# EAGLE board ESP32 Display-1.28-V1.0 (EAGLE 9.6.2)
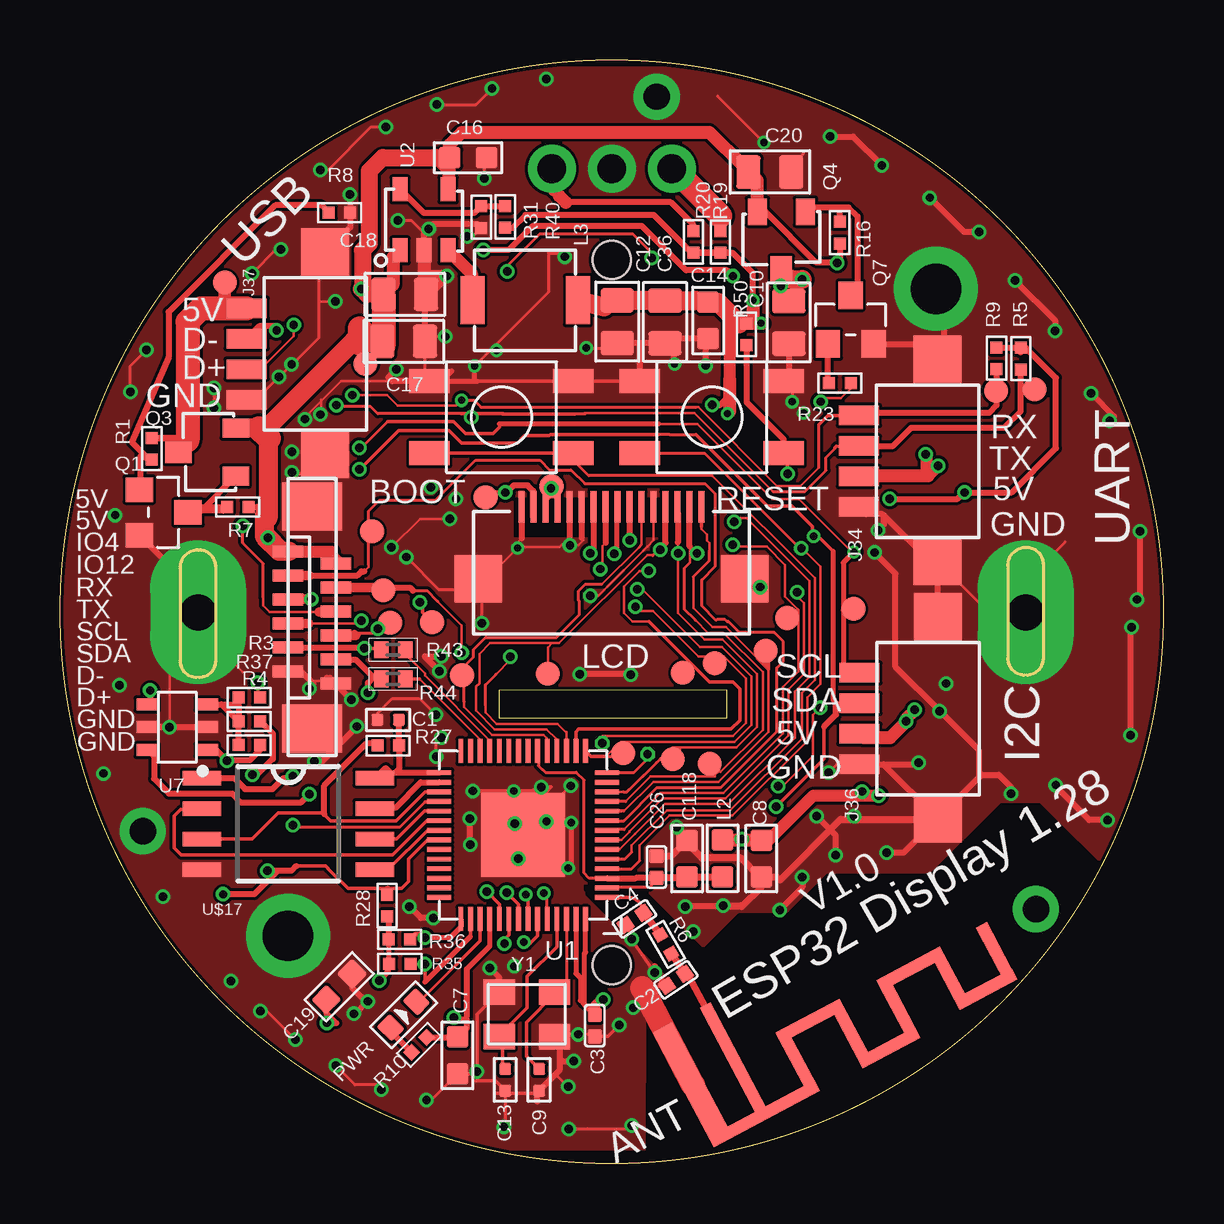
[diagram p6: board, top side]
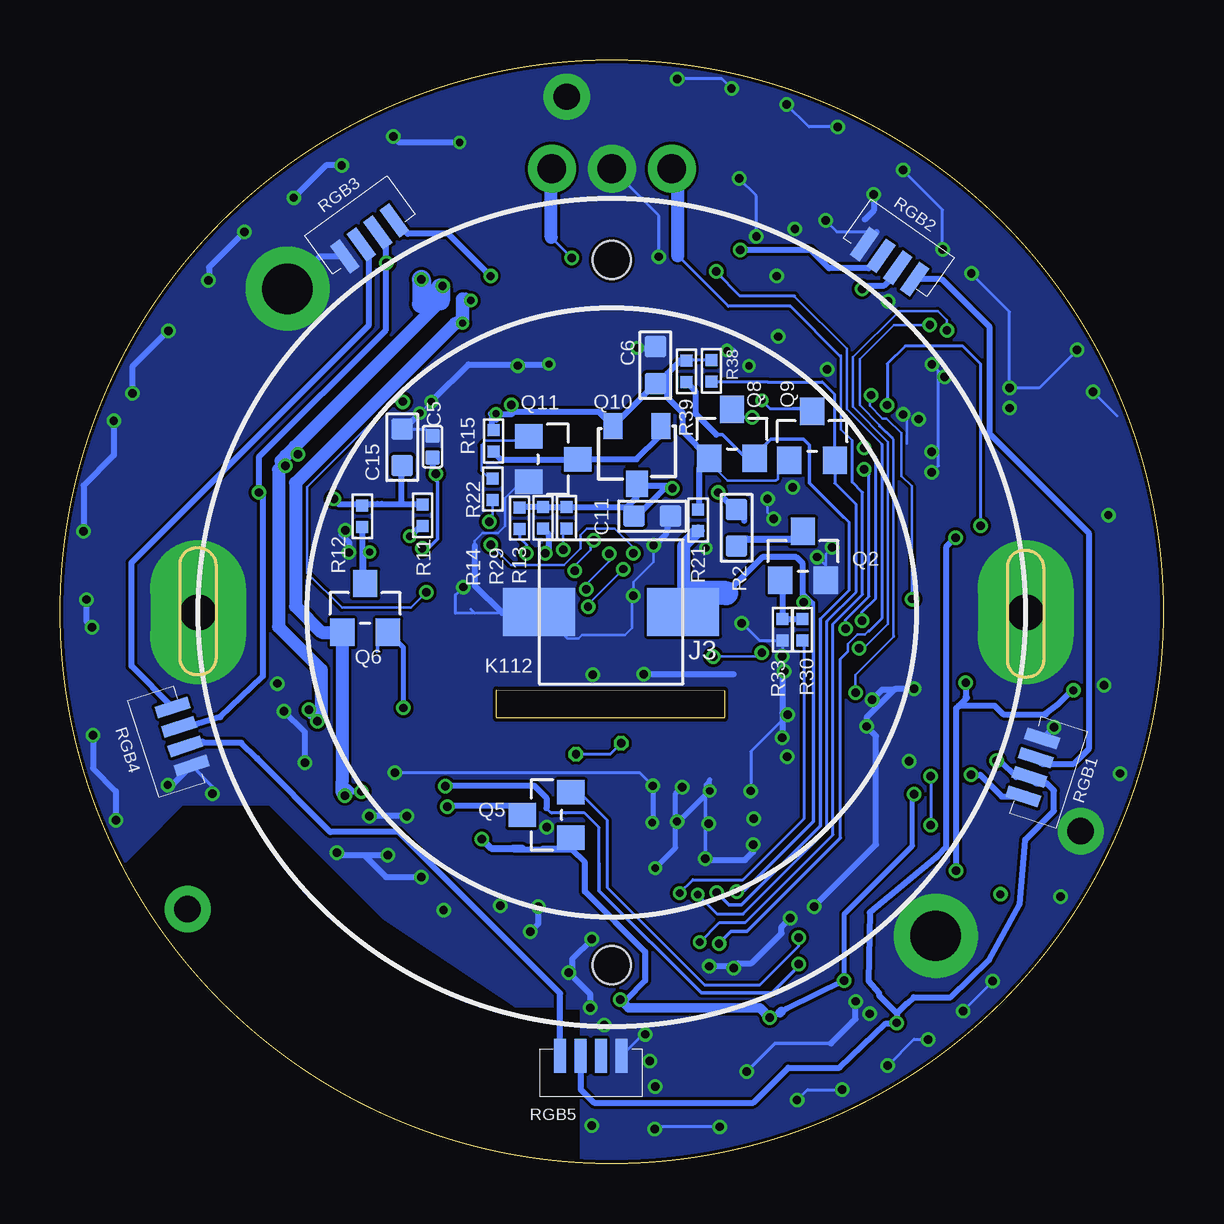
[diagram p7: board, bottom side, seen from below]

Size 46 x 46 mm. Coordinates in mm from the lower left corner, seen from the top.
Outline: 18.3,19.72 18.3,18.57 27.8,18.58 27.8,19.73 18.3,19.72
Outline: circle at 23,23 radius 23
Copper layers (1*16): Top 0.035mm / dielectric 1.5mm / Bottom 0.035mm
Design rules "default *": minimum track width 3mil, minimum drill 0.3mm, track to track 4mil, track to pad 4mil, pad to pad 4mil, via to via 4mil, smd to smd 5mil, copper to edge 6mil, drill to drill 6mil, minimum pad ring 5mil, minimum via ring 5mil, stop-mask expansion 4mil, vias tented up to drill 30mil, thermal gap 5mil
Net classes: 0 default: clearance 0.12 mm; 1 PWR: width 0.254 mm, clearance 0.12 mm to class 0, clearance 0.12 mm

## Footprints (pad centres in the part's own frame; a part is rotated, then mirrored left to right if it is on the bottom)
BT_ANT = smd 0.9 x 5.4: P$1 0,0 | smd 0.5 x 5.4: P$2 -2,0 | smd 5 x 0.5: P$3 -2.053,2.455 | smd 0.5 x 3: P$4 -4.305,1.198; P$6 -6.82,1.195 | smd 3 x 0.5: P$5 -5.57,-0.06; P$9 -10.285,-0.01 | smd 2.7 x 0.5: P$7 -7.93,2.465; P$11 -12.65,2.21 | smd 0.5 x 2.7: P$8 -9.045,1.37; P$10 -11.53,1.095; P$12 -13.74,1.105
SW-4.5*4.5 = smd 1.676 x 1: P$1 -3,1.5; P$2 -3,-1.5; P$3 3,-1.5; P$4 3,1.5
0402 = smd 0.5 x 0.5: 1 -0.45,0; 2 0.45,0
C0402 = smd 0.6 x 0.6: 1 -0.45,0; 2 0.45,0
0603 = smd 0.889 x 0.889: 1 -0.762,0; 2 0.762,0
C0603 = smd 0.889 x 0.889: 1 -0.762,0; 2 0.762,0
0805 = smd 1.016 x 1.397: 1 -0.889,0; 2 0.889,0
EC3501-C15H30P3 = drill 1.2 pad 2: 1 -2.5,-18.5; 2 0,-18.5; 3 2.5,-18.5 | drill 1.5 pad 4 long: 4 -17.25,0; 5 17.25,0 | hole 1.6: 0,14.7; 0,-14.7
1.25-4P立贴 = smd 0.813 x 1.676: 1 1.27,2; 2 0,2; 3 -1.27,2; 4 -2.54,2 | smd 2 x 2: 5 -4.8,-1.27; 6 3.6,-1.27
BUTTON_2P = smd 3 x 2: P$1 0,0; P$2 6,0
L0603 = smd 0.889 x 0.889: 1 -0.762,0; 2 0.762,0
L0420 = smd 2 x 1: 1 0,2.2; 2 0,-2.2
0.5MM-16P = smd 0.27 x 1.27: 1 -5.08,2.54; 2 -4.58,2.54; 3 -4.08,2.54; 4 -3.58,2.54; 5 -3.08,2.54; 6 -2.58,2.54; 7 -2.08,2.54; 8 -1.58,2.54; 9 -1.08,2.54; 10 -0.58,2.54; 11 -0.08,2.54; 12 0.42,2.54; 13 0.92,2.54; 14 1.42,2.54; 15 1.92,2.54; 16 2.42,2.54 | smd 2 x 2: 17 -6.88,-0.46; 18 4.22,-0.46
PAD-1.0MM = smd 1 x 1: P$1 0,0
LED-0603 = smd 0.762 x 0.889: + -0.762,0; - 0.762,0
SOT23@1 = smd 1.016 x 1.143: 1 -0.95,-1.016; 2 0.95,-1.016; 3 0,1.016
SOT23 = smd 1.016 x 1.143: 1 -0.95,-1.016; 2 0.95,-1.016; 3 0,1.016
SOT-23 = smd 1.1 x 0.8: 1 1.2,-1; 2 1.2,1 | smd 1.1 x 0.9: 3 -1.2,0
0402' = smd 0.5 x 0.5: P$1 -0.45,0; P$2 0.45,0
R0603 = smd 0.889 x 0.889: 1 -0.762,0; 2 0.762,0
R0402 = smd 0.6 x 0.7: 1 -0.5,0; 2 0.5,0
RGB4020 = smd 0.5 x 1.422: 1 0,0; 2 -0.85,0; 3 -1.7,0; 4 -2.55,0
T-2.5 = drill 2.1 pad 3.5: 1 0,0
ESP-S3-QFN56(7×7MM) = smd 1 x 0.2: 1 -3.5,2.6; 2 -3.5,2.2; 3 -3.5,1.8; 4 -3.5,1.4; 5 -3.5,1; 6 -3.5,0.6; 7 -3.5,0.2; 8 -3.5,-0.2; 9 -3.5,-0.6; 10 -3.5,-1; 11 -3.5,-1.4; 12 -3.5,-1.8; 13 -3.5,-2.2; 14 -3.5,-2.6; 29 3.5,-2.6; 30 3.5,-2.2; 31 3.5,-1.8; 32 3.5,-1.4; 33 3.5,-1; 34 3.5,-0.6; 35 3.5,-0.2; 36 3.5,0.2; 37 3.5,0.6; 38 3.5,1; 39 3.5,1.4; 40 3.5,1.8; 41 3.5,2.2; 42 3.5,2.6 | smd 0.2 x 1: 15 -2.6,-3.5; 16 -2.2,-3.5; 17 -1.8,-3.5; 18 -1.4,-3.5; 19 -1,-3.5; 20 -0.6,-3.5; 21 -0.2,-3.5; 22 0.2,-3.5; 23 0.6,-3.5; 24 1,-3.5; 25 1.4,-3.5; 26 1.8,-3.5; 27 2.2,-3.5; 28 2.6,-3.5; 43 2.6,3.5; 44 2.2,3.5; 45 1.8,3.5; 46 1.4,3.5; 47 1,3.5; 48 0.6,3.5; 49 0.2,3.5; 50 -0.2,3.5; 51 -0.6,3.5; 52 -1,3.5; 53 -1.4,3.5; 54 -1.8,3.5; 55 -2.2,3.5; 56 -2.6,3.5 | smd 3.5 x 3.5: 57 0,0
SOT23-5 = smd 1 x 0.635: 1 -1.27,1; 2 -1.27,0; 3 -1.27,-1; 4 1.27,-1; 5 1.27,1
SOT23-6L = smd 0.5 x 0.9: 1 -0.961,-1.212; 2 -0.011,-1.212; 3 0.94,-1.212; 4 0.94,1.288; 5 -0.011,1.288; 6 -0.961,1.288
FLASHSOP8_SOP8 = smd 0.6 x 1.6: 1 -1.905,-3.6; 2 -0.635,-3.6; 3 0.635,-3.6; 4 1.905,-3.6; 5 1.905,3.6; 6 0.635,3.6; 7 -0.635,3.6; 8 -1.905,3.6
CON-0.5-12P-U = smd 0.5 x 1.27: P$1 0,-2; P$2 0.5,0; P$3 1,-2; P$4 1.5,0; P$5 2,-2; P$6 2.5,0; P$7 3,-2; P$8 3.5,0; P$9 4,-2; P$10 4.5,0; P$11 5,-2; P$12 5.5,0 | smd 2 x 2.5: P$13 -1.88,-1; P$14 7.38,-1
T-2-1.1 = drill 1.1 pad 1.93: P$1 0,0
CRYSTAL-3.2-2.5 = smd 1.3 x 1.05: 1 -1.15,-0.925; 2 1.15,-0.925; 3 1.15,0.925; 4 -1.15,0.925

## Placement (x,y rotation side)
ANT  BT_ANT  [BT_ANT]  26.39,3.28 208 top
BOOT  BOOT  [SW-4.5*4.5]  18.4,31.11 0 top
C1  1UF  [0402]  13.68,18.49 180 top
C2  NC  [C0402]  25.67,7.66 34 top
C3  1uF  [C0402]  22.29,5.75 90 top
C4  NC  [C0402]  23.94,10.2 34 top
C5  1uF  [C0402]  30.47,29.88 270 bottom
C6  100NF  [0603]  21.18,33.28 90 bottom
C7  1uF  [C0603]  16.57,4.51 270 top
C8  10NF  [C0603]  29.23,12.71 270 top
C9  12pF  [0402]  19.97,3.49 270 top
C10  22uF  [0805]  30.38,35.06 90 top
C11  100NF  [0603]  21.31,26.98 0 bottom
C12  22uF  [0805]  23.23,35.09 90 top
C13  12pF  [0402]  18.56,3.49 270 top
C14  100NF  [C0603]  27.02,35.14 270 top
C15  100NF  [0603]  31.73,29.86 90 bottom
C16  100NF  [0603]  17.01,41.92 0 top
C17  22uF  [0805]  14.33,34.27 180 top
C18  22uF  [0805]  14.37,36.23 180 top
C19  100NF  [0603]  11.64,7.37 45 top
C20  22uF  [0805]  29.59,41.33 180 top
C26  1uF  [C0402]  24.86,12.36 90 top
C36  22uF  [0805]  25.22,35.08 90 top
C118  NC/3PF  [0603]  26.14,12.71 270 top
J3  EC3501-C15H30P3  [EC3501-C15H30P3]  23,22.97 180 bottom
J34  1.25-4P-SMT-A  [1.25-4P立贴]  35.3,29.91 90 top
J36  1.25-4P-SMT-A  [1.25-4P立贴]  35.32,19.18 90 top
J37  1.25-4P-SMT-A  [1.25-4P立贴]  9.78,34.38 90 top
K112  BUTTON_2P  [BUTTON_2P]  26.03,22.99 0 bottom
L2  100M-600R  [L0603]  27.62,12.72 270 top
L3  2.2UH  [L0420]  19.39,35.98 90 top
LCD  LCD-1.28-16P-1.28  [0.5MM-16P]  24.32,24.83 0 top
P1  [PAD-1.0MM]  17.74,27.78 0 top
P2  [PAD-1.0MM]  20.49,28.23 0 top
P3  [PAD-1.0MM]  30.32,22.74 0 top
P4  [PAD-1.0MM]  27.29,20.85 0 top
P5  [PAD-1.0MM]  23.47,17.11 0 top
P6  [PAD-1.0MM]  25.96,20.45 0 top
P7  [PAD-1.0MM]  16.76,20.35 0 top
P8  [PAD-1.0MM]  20.34,20.41 0 top
P9  [PAD-1.0MM]  25.55,16.85 0 top
P10  [PAD-1.0MM]  27.08,16.66 0 top
P11  [PAD-1.0MM]  29.41,21.38 0 top
P12  [PAD-1.0MM]  13.01,26.35 0 top
P13  [PAD-1.0MM]  13.47,23.9 0 top
P14  [PAD-1.0MM]  39.02,32.21 0 top
P15  [PAD-1.0MM]  40.63,32.27 0 top
P16  [PAD-1.0MM]  33.08,23.12 0 top
P17  [PAD-1.0MM]  13.76,22.55 0 top
P18  [PAD-1.0MM]  15.51,22.57 0 top
P19  [PAD-1.0MM]  6.87,36.72 0 top
P20  [PAD-1.0MM]  12.73,33.34 0 top
PWR  Green  [LED-0603]  14.32,6.2 45 top
Q1  S9013  [SOT23@1]  4.32,27.14 270 top
Q2  BSN20  [SOT23]  15.03,25.33 0 bottom
Q3  PMOS-3401-4A  [SOT-23]  6.13,29.65 0 top
Q4  PMOS-3401-4A  [SOT-23]  30.07,38.47 90 top
Q5  BSN20  [SOT23]  25.72,14.53 90 bottom
Q6  BSN20  [SOT23]  33.28,23.16 0 bottom
Q7  S9013  [SOT23@1]  32.96,35.18 0 top
Q8  BSN20  [SOT23]  17.99,30.42 0 bottom
Q9  BSN20  [SOT23]  14.65,30.33 0 bottom
Q10  PMOS-3401-4A  [SOT-23]  21.95,29.54 90 bottom
Q11  S9013  [SOT23@1]  25.44,29.36 270 bottom
R1  10K  [0402']  3.83,29.8 90 top
R2  10R  [R0603]  17.8,26.5 90 bottom
R3  NC  [0402']  7.89,19.42 0 top
R4  10K  [0402']  7.89,17.44 0 top
R5  10k  [0402']  40.05,33.55 90 top
R6  0R  [0402']  25.25,9.14 120 top
R7  10K  [0402']  7.41,27.37 0 top
R8  10K  [0402']  11.65,39.64 180 top
R9  10k  [0402']  39.04,33.57 90 top
R10  1K  [0402']  14.97,4.95 45 top
R11  10k  [0402']  30.89,27.02 90 bottom
R12  10k  [0402']  33.4,26.98 90 bottom
R13  10K  [0402']  24.89,26.92 270 bottom
R14  10K  [0402']  26.84,26.9 270 bottom
R15  10K  [0402']  27.93,30.12 90 bottom
R16  10K  [0402']  32.5,38.8 270 top
R19  10K  [0402']  27.53,38.41 270 top
R20  10K  [0402']  26.4,38.42 270 top
R21  10K  [0402']  19.4,26.82 90 bottom
R22  10K  [0402']  27.96,28.11 270 bottom
R23  10K  [0402']  32.51,32.53 0 top
R27  10K  [0402']  13.68,17.42 180 top
R28  4.7K  [0402']  13.64,10.75 270 top
R29  10K  [0402']  25.87,26.92 270 bottom
R30  10K  [0402']  15.05,22.25 90 bottom
R31  24K  [0402']  17.56,39.45 90 top
R33  100K  [0402']  15.89,22.25 90 bottom
R35  10k  [0402']  14.17,8.33 180 top
R36  10k  [0402']  14.15,9.35 0 top
R37  100R  [0402']  7.89,18.43 180 top
R38  10k  [0402']  18.84,33.04 90 bottom
R39  10k  [0402']  19.89,33.02 270 bottom
R40  110K  [0402']  18.56,39.46 270 top
R43  10R  [R0402]  13.89,21.42 0 top
R44  10R  [R0402]  13.89,20.2 0 top
R50  10K  [0402']  28.62,34.56 270 top
RESET  RESET  [SW-4.5*4.5]  27.17,31.11 180 top
RGB1  RGB4020_E  [RGB4020]  5.85,15.3 252 bottom
RGB2  RGB4020_E  [RGB4020]  10.38,36.86 325 bottom
RGB3  RGB4020_E  [RGB4020]  32.06,39.31 36 bottom
RGB4  RGB4020_E  [RGB4020]  41.3,19.01 108 bottom
RGB5  RGB4020_E  [RGB4020]  25.15,4.49 180 bottom
T1  T2.5-A  [T-2.5]  9.5,9.49 0 bottom
T2  T2.5-A  [T-2.5]  36.52,36.46 0 top
U1  ESP-S3-QFN56(7×7MM)  [ESP-S3-QFN56(7×7MM)]  19.31,13.69 180 top
U2  RY3420  [SOT23-5]  15.18,39.34 90 top
U7  AIP74LVC1T45GB236  [SOT23-6L]  4.93,18.2 90 top
U$17  FLASHSOP8_W25X20CL  [FLASHSOP8_SOP8]  9.52,14.16 270 top
U$27  CON-12P-0.5-U  [CON-0.5-12P-U]  11.5,25.51 270 top
U$28  T-2-1.1  [T-2-1.1]  3.45,13.85 0 top
U$30  T-2-1.1  [T-2-1.1]  40.68,10.6 0 bottom
U$31  T-2-1.1  [T-2-1.1]  24.88,44.47 0 top
Y1  3225_40M  [CRYSTAL-3.2-2.5]  19.46,6.22 180 top

## Tracks (layer width: path | path; a pad name or v marks a point on that pad's centre or on a via)
3.3V
  Top 0.127: U1.20 19.94,17.16 19.94,16.58 20.1,16.42 20.12,16.42 20.23,16.31 21.52,16.31 21.85,15.99 21.85,12.11 22.06,11.89 U1.3 | U1.2 22.84,11.52 24.58,11.52 24.96,11.9
  Top 0.254: C26.1 24.96,11.9 24,11.9 23.99,11.89 U1.3
  Top 0.3: 24.96,11.9 26.09,11.9 C118.2 27.61,11.95 L2.2
22
  cutout Top: 24.11,11.64 27.58,8.17 25.98,7.13 21.92,11.19 21.92,11.33 21.86,11.39 21.86,11.62
33
  cutout Top: 18.93,27.72 18.93,26.14 26.96,26.14 27.05,26.05 27.05,27.43 27.35,27.73 18.94,27.73
ESP_RXD  (via drill 0.3)
  Top 0.152: v19.42,11.21 19.51,11.12 U1.50
  Bottom 0.12: 13.4,29.61 13.68,29.33 Q9.2
  Bottom 0.125: v19.42,11.21 18.61,10.4 17.53,10.4 14.03,13.9 14.03,22.61 12.81,23.83 12.81,27.47 13.7,28.36 Q9.2 | 13.72,32.08 13.72,29.37 13.68,29.33
  Bottom 0.127: R38.P$1 16.5,32.59 16.51,32.58 14.22,32.58 13.72,32.08 | 13.27,29.75 13.4,29.61
ESP_TXD  (via drill 0.35)
  Top 0.152: v18.62,11.29 19.11,10.8 U1.49
  Bottom 0.125: 14.3,22.7 13.1,23.9 13.1,26.72 13.32,26.94 13.34,26.94
  Bottom 0.152: 18.64,30.38 18.39,30.38 17.41,29.4 Q8.2 17.04,29.52 16.37,30.19 15.02,30.19 14.77,29.94 14.77,28.37 13.34,26.94 | v18.62,11.29 18.12,10.79 17.59,10.79 14.3,14.08 14.3,22.7
  Bottom 0.254: 18.64,30.38 19.52,31.26 19.52,32.2 R39.P$2
GND  (via drill 0.3, 0.35)
  Top 0.1: 19.24,26.06 18.88,25.7 19.11,25.7 | 19.11,25.7 v19.07,25.66 17.44,24.03 | 17.44,24.03 17.44,23.93 | 17.44,24.03 LCD.17 | 19.11,25.7 20.82,25.7 20.9,25.78 | 21.25,26.12 20.9,25.78 | 21.74,26.09 21.83,26 21.61,25.78 v21.26,25.78 20.9,25.78 | 24.75,26.9 24.75,25.98 24.49,25.71 22.44,23.67 v22.1,23.67 | 11.13,20.24 11.01,20.12 10.57,20.12 10.57,20 | v10.39,19.8 10.39,20.18 | 7.61,20.49 5.98,22.12 | 5.98,22.12 5.75,22.35 J3.4 | v4.57,18.18 4.57,20.71 5.98,22.12 | 13.86,32.61 11.72,32.61 10.18,31.07 v10.21,31.03 | 10.88,31.85 10.88,31.26 v10.85,31.22 | v13.82,25.69 15,26.87 v16.25,26.87 | C17.1 15.42,34.47 v16.07,34.47 | 10.8,35.96 10.83,35.93 v11.48,35.93
  Top 0.12: 25.49,7.41 C2.1
  Top 0.125: v29.19,24.03 28.66,24.03 LCD.18 | C1.2 13.23,18.76 13.85,19.38 14.99,19.38 v15.66,18.71 | v32.04,16.3 32.38,16.64 J36.4 | 36.53,14.44 36.44,14.35 35.24,14.35 | 11.04,29.5 J37.5 11.05,28.74 9.73,28.74 v9.66,28.81 | 15.18,38.78 14.65,39.31 v14.09,39.31 | 17.14,39.16 17.02,39.16 | R31.P$1 17.21,38.65 v16.97,38.65 | v17.69,41.06 17.69,41.84 C16.2 | v29.34,42.56 27.41,44.49 | 36.86,33.8 36.71,33.65 J34.6 37.31,32.77 | RESET.P$2 30.23,32.55 30.52,32.26 v30.52,31.76 | 31,42.14 C20.1 | J34.5 38.7,22.98 40.26,22.98 | J3.5 40.25,24.26 41.9,25.91 | v14.44,25.28 15.79,23.93 17.44,23.93 | J37.4 8.11,32.17 8.52,32.17 v9.65,33.3 9.69,33.3 10.8,34.42 10.8,35.96 10.8,37.73 J37.6 | BOOT.P$1 15.22,32.79 C17.1 | v21.04,37.8 21.04,37.95 20.36,37.95 20.36,36.33 v17.28,33.25 17.92,33.89 v18.2,33.89 | 17.38,3.47 17.38,3.75 | Y1.4 20.7,5.39 v21.61,5.39 22.21,5.39 C3.1 | LCD.17 17.57,23.78 v17.57,22.53 v17.58,22.52 | 23.1,5.56 v23.32,5.78 | 20.62,3.69 20.7,3.69 v21.18,3.2 | C13.2 18.56,1.61 18.5,1.55 v18.5,1.53 | v21.21,1.44 21.96,1.44 21.97,1.45 23.68,1.45 v23.82,1.59 v23.83,1.59 | C7.2 15.46,2.64 v15.28,2.64 | v13.4,3.08 13.2,3.28 12.3,3.28 v11.5,4.08 | v9.81,5.17 8.62,6.36 v8.35,6.36 | v2.48,19.93 2.37,20.04 | v2.93,32.16 2.93,33.24 v3.6,33.91 | v6.42,32.33 v6.42,31.49 | v9.21,38.11 9.02,38.11 v8.01,37.1 | v10.86,41.41 11.17,41.41 12.97,43.21 v13.58,43.21 | v15.71,44.14 17.34,44.14 v18.01,44.81 | 36.96,19.98 v36.93,20.01 | v15.68,16.96 15.68,17.67 15.76,17.75 v15.89,17.75 | 24.28,7.32 C2.1
  Top 0.127: v21.94,34 23.03,34 C12.1 | U1.57 19.31,13.76 v21.29,15.74
  Top 0.152: BOOT.P$1 15.91,32.61 17.23,32.61 | 17.4,32.61 BOOT.P$4 RESET.P$3 | C9.2 19.89,2.97 19.86,2.93 18.67,2.93 | 18.67,2.93 C13.2 18.16,3.44 17.35,3.44 17.38,3.47 | C7.2 17.38,3.75 v17.38,3.82 | Y1.2 17.39,6.23 17.39,5.95 17.38,5.94 v17.38,3.82 | 18.12,2.93 18.67,2.93 | v17.38,3.82 v17.38,3.83 | 19.76,15.53 v18.92,15.53 v17.2,15.53 | v20.07,15.7 20.48,15.7 20.28,15.5 v20.28,14.26 19.04,14.26 v18.95,14.17 | 39.65,15.68 v39.65,15.41 | v23.83,9.35 24.76,7.99 v24.78,7.95 24.85,7.86 C2.1
  Top 0.154: C3.1 22.84,5.3 23.1,5.56
  Top 0.2: 16.34,33.04 15.91,32.61 | 20.86,5.3 20.79,5.23 20.73,5.18 | v21.31,14.21 21.31,12.43 v21.19,12.31 | BOOT.P$1 17.23,32.61 | 17.23,32.61 17.4,32.61 | 17.23,32.61 17.28,32.66 v17.28,33.25
  Top 0.25: LCD.1 19.24,26.06 | LCD.5 21.25,26.91 21.25,26.12 | LCD.6 21.74,26.09
  Top 0.254: 25.27,34.24 25.41,34.38 C14.2 26.91,34.27 v26.91,33.26 | 25.27,34.24 C36.1 24.3,34.2 | 24.3,34.2 C12.1 | 40.26,22.98 J3.5 | C2.1 24.82,7.89 24.82,8.21 24.79,8.24 | 20.73,5.18 Y1.4 | 19.89,2.59 19.89,2.97 | 23,41.42 J3.2 | 40.82,22.43 40.26,22.98 | 40.52,23.24 40.26,22.98 | RESET.P$3 24.17,34.07 24.3,34.2 | v25.62,33.32 25.58,33.36 25.58,33.93 25.27,34.24 | U1.57 19.31,15.08 19.76,15.53 | LCD.12 24.75,26.9 | C17.1 15.22,36.19 C18.1 | U2.2 15.18,38.78 v15.37,38.97 15.56,39.16 17.02,39.16 | 17.14,39.16 17.4,39.16 R31.P$1 | J34.4 33.6,27.07 34.29,27.07 | Q1.2 5.7,23.79 5.7,23.02 J3.4 | J36.6 36.59,25.09 J34.5 36.26,25.11 34.35,27.02 34.35,26.65 v34.1,26.4 | J37.6 12.1,39.03 R8.P$1 12.1,40.37 v12.08,40.39 | C9.2 20.62,3.69 20.84,3.91 20.84,4.37 | 20.79,5.23 20.84,5.18 20.84,4.37 | v4.57,18.18 v4.56,18.19 U7.5 U7.2 | J36.5 38.3,16.09 | 38.3,16.09 38.41,16.2 39.13,16.2 39.65,15.68 | J36.5 36.53,14.44 34.33,16.64 J36.4 35.73,16.64 v35.79,16.7 | 11.13,20.24 11.24,20.24 v12.14,19.34 | v12.38,18.22 10.91,16.75 10.61,16.75 v10.61,16.77 | v15.82,20.52 15.2,21.14 v15.89,21.14 | Y1.2 18.31,7.76 v17.92,8.15 | v15.56,10.23 15.05,10.23 v14.57,10.71 | v17.11,13.3 17.09,13.32 v17.09,14.37 | v21.67,20.39 21.7,20.42 23.75,20.42 v23.79,20.38 | v33.95,25.47 34.83,24.59 34.83,20.7 v36.67,18.86 38.3,17.23 38.3,16.09 | J36.5 35.16,12.95 v34.46,12.95 | v32.34,12.86 32.34,13.68 v31.54,14.48 v31.55,14.49 | 36.86,33.8 36.86,36.12 T2.1 | BOOT.P$1 13.86,32.61 13.7,32.77 v14.02,33.1 | v32.1,42.81 33.06,42.81 v34.26,41.61 | v36.26,40.26 37.68,38.84 v38.31,38.84 | v39.81,36.81 41.48,35.14 v41.48,34.71 | v42.98,32.11 43.95,31.14 v43.76,30.96
  Top 0.254: v45.02,26.35 45.02,23.63 v44.9,23.51 | v44.66,22.36 44.62,22.32 v44.62,17.85 | v43.67,14.32 42.9,14.32 41.51,15.71 v41.51,15.78 | v30.94,11.94 30.94,11.52 v30,10.58 v30.01,10.57 | v12.84,6.76 12.79,6.71 | 12.79,6.71 12.32,6.24 v12.25,6.24 | 20.84,4.37 20.94,4.27 v21.41,4.27 | C4.1 23.83,9.69 v23.83,9.35 | v27.64,10.75 27.6,10.71 v26.07,10.71 | C118.1 25.76,13.85 25.76,13.97 v25.71,14.02 | C10.1 30.38,32.71 30.23,32.55 | Q7.2 36.19,34.16 36.71,33.65 | C19.2 12.18,7.32 12.79,6.71 | U$27.P$11 10.06,20.51 10.39,20.18 10.57,20
  Top 0.3: C118.1 26.08,13.41 | 26.08,13.41 25.48,12.81 C26.2 | C8.2 29.16,11.95 28.38,12.73 26.76,12.73 26.08,13.41 | C8.2 29.86,11.95 30,11.81 32.54,14.35 36.44,14.35 | v27.64,10.75 28.38,10.75 28.42,10.71 29.23,11.52 C8.2
  Top 0.54: U2.2 15.18,37.03 15.22,36.99 v16.13,36.99 16.02,36.99 15.22,36.19
  Top 1: ANT.P$1 24.28,7.32
  Bottom 0.1: v31,31.28 v30.52,31.76 30.44,31.84 | v21.26,25.78 21.26,25.69 21.26,25.07 22.1,24.23 v22.1,23.67 22.16,23.61 22.16,22.33 22.45,22.04 24.24,22.04 24.39,21.89 24.85,21.89 24.86,21.91 25.28,22.32 | K112.P$1 26.08,22.94 26.65,22.94 28.71,22.94 29.52,22.94 | 28.71,25.76 28.71,25.94 28.38,26.27 27.75,26.27 27.45,26.57 27.45,27.74 26.78,28.41 Q11.2 | v10.85,31.22 10.7,31.07 10.7,30.01 | Q2.2 14.08,25.41 13.82,25.67 v13.82,25.69 | v16.25,26.87 16.51,27.13 v16.51,27.71
  Bottom 0.125: v29.19,24.03 29.52,23.7 29.52,22.94 | v17.2,15.53 17.2,17.17 v15.66,18.71 15.75,18.8 15.89,18.8 | v21.29,15.74 21.85,16.3 v32.04,16.3 | R33.P$1 v15.89,21.14 | v14.09,39.31 13.62,38.84 11.96,38.84 | v16.97,38.65 16.97,40.34 v17.69,41.06 | C15.2 30.76,30.62 C5.1 | 14.08,24.92 v14.44,25.28 | v21.04,37.8 21.04,39.51 J3.2 | 28.88,23.11 28.71,22.94 | RGB5.4 21.71,5.39 v21.61,5.39 | v9.66,28.81 9.38,29.09 9.38,33.03 v9.65,33.3 | 24.86,21.91 25.76,22.8 25.85,22.8 | v18.5,1.53 21.12,1.53 v21.21,1.44 | v15.28,2.64 14.84,3.08 v13.4,3.08 | v11.5,4.08 10.4,5.18 v9.81,5.18 v9.81,5.17 | v8.35,6.36 7.12,7.59 v7.12,7.61 | 2.19,26.92 v2.3,27.03 | 1.94,31.17 v2.93,32.16 | v3.6,33.91 5.18,32.33 v6.42,32.33 6.42,35.51 v8.01,37.1 | v9.21,38.11 9.21,39.76 v10.86,41.41 | v13.58,43.21 14.78,43.21 v15.71,44.14 | v18.01,44.81 18.41,45.21 v20.27,45.21
  Bottom 0.127: v17.58,22.52 17.56,22.52 16.84,21.8 R33.P$1
  Bottom 0.152: v17.38,3.83 16.2,5.01 13.86,5.01 | 27.75,10.59 v27.64,10.75 | 17.11,15.52 v17.19,15.52 v17.2,15.53 | 18.92,15.99 19.1,15.81 v19.1,12.7 | RGB4.4 39.65,15.72 v39.65,15.41
  Bottom 0.2: v21.29,15.74 21.29,14.21 v21.3,14.2 v21.31,14.21 | v21.19,12.31 20.34,13.16 20.34,15.42 v20.07,15.7 | 18.92,15.99 v18.92,15.53 20.19,14.26 v20.28,14.26 | 17.92,33.89 v18.2,33.89
  Bottom 0.254: C15.2 31.66,30.62 v31,31.28 | 30.44,31.84 28.97,33.31 25.72,33.31 25.68,33.27 v25.62,33.32 | 40.45,16.52 RGB4.4 41.32,15.78 v41.51,15.78 | RGB2.4 11.96,38.84 | v12.08,40.39 12.08,39.72 12.46,39.35 | RGB1.4 5.02,17.73 v4.57,18.18 | K112.P$1 25.85,22.8 25.36,22.32 | v12.14,19.34 11.72,19.76 11.21,19.76 | 10.3,19.8 v10.39,19.8 11.17,19.8 11.21,19.76 | 11.21,19.76 12.38,18.59 v12.38,18.22 11.98,17.82 11.98,13.3 v14.57,10.71 | v15.89,17.75 15.89,18.8 15.89,20.45 v15.82,20.52 | 15.51,10.23 v15.56,10.23 15.92,9.87 15.92,9.6 17.17,8.35 17.72,8.35 v17.92,8.15 17.99,8.22 v18.93,8.22 | v19.1,12.7 19.05,12.65 17.44,12.65 17.11,12.98 v17.11,13.3 | 17.92,20.39 v21.67,20.39 | v35.79,16.7 35.79,17.98 v36.67,18.86 | v34.1,26.4 34.27,26.23 33.95,25.91 v33.95,25.47 | v34.46,12.95 34.37,12.86 33.33,12.86 | 33.33,12.86 v32.34,12.86 | v31.55,14.49 v33.11,14.49 v33.11,14.48 | RGB3.4 35.17,37.81 T2.1 | v29.34,42.56 31.85,42.56 v32.1,42.81 | v34.26,41.61 34.91,41.61 v36.26,40.26 | v38.31,38.84 39.79,37.36 39.79,36.83 v39.81,36.81 | v41.48,34.71 42.98,33.21 v42.98,32.11 | v43.76,30.96 43.76,29.53 45.02,28.27 v45.02,26.35 | v44.9,23.51 44.9,22.6 v44.66,22.36 | v44.62,17.85 44.62,16.47 43.67,15.52 v43.67,14.32 | 33.33,12.86 32.41,11.94 v30.94,11.94 | 13.86,5.01 12.84,6.03 v12.84,6.76 | v23.83,9.35 24.65,8.53 24.65,7.86 24.69,7.86 v24.78,7.95 23.9,7.07 v23.9,6.49 | v26.07,10.71 26.07,10 v26.4,9.67 | C11.2 20.76,26.19 21.26,25.69 | 28.71,25.76 28.71,24.09 27.56,22.94 26.65,22.94 | v21.94,34 21.22,34 C6.2
  other vias: 4.29,11.13 1.81,16.26 9.67,29.67 9.12,32.79 15.46,28.19
  pour Top (no thermals): 6.22,45.65 32.83,45.65 40.73,37.75 45.83,32.65 45.83,20.46 45.83,11.13 38.95,4.25 36.29,1.59 36.29,0.62 10.26,0.62 8.59,2.29 -0.36,11.24 -0.36,15.12 -0.36,39.78 3.48,43.62 5.51,45.65 6.21,45.65
  pour Bottom (no thermals): -0.16,46.21 -0.16,10.58 6.9,3.52 10.74,-0.32 17.11,-0.32 36.64,-0.32 36.9,-0.06 46.41,9.45 46.41,15.74 46.41,36.87 41.35,41.93 36.2,47.08 27.92,47.08 0.71,47.08
GPIO0
  Top 0.1: 23.83,12.97 23.83,13.26 25.3,14.72 27.94,14.72 30.92,17.71 30.92,19.61 31.46,20.15 31.46,24.4 27.19,28.68 | BOOT.P$3 21.02,29.61 20.97,29.66
  Top 0.125: 27.19,28.68 22.03,28.68 21.05,29.66
  Top 0.127: U1.5 23.55,12.69 23.83,12.97
  Top 0.152: 21.78,29.23 BOOT.P$3 BOOT.P$2 | 21.05,29.66 20.97,29.66
GPIO1  (via drill 0.35)
  Top 0.1: U1.6 23.32,13.09 23.97,13.73 23.97,13.74 25.22,14.99 27.87,14.99 30.63,17.75 30.63,19.67 31.24,20.28 31.24,24.28 28.61,26.91 28.06,26.91 28.06,26.79 v28.1,26.75
  Bottom 0.1: v28.1,26.75 27.96,26.89 R22.P$2
GPIO2  (via drill 0.35)
  Top 0.1: U1.7 23.41,13.49 23.75,13.83 23.75,13.84 25.12,15.22 27.74,15.22 30.36,17.85 30.36,19.75 31.02,20.41 31.02,23.37 30.65,23.73 v30.74,23.82 | v30.74,23.82 30.79,23.87 | v30.74,23.82 | v30.74,23.82 v30.73,23.81 | v31.7,31.76 31.84,31.9 32.56,31.9 32.96,32.3 R23.P$2
  Bottom 0.1: v30.73,23.81 31.37,23.17 34.25,23.17 35.69,24.61 35.69,28.2 32.13,31.76 v31.7,31.76
GPIO4
  Top 0.1: U$27.P$3 9.7,24.55 | 9.7,24.55 9.74,24.59 | 12.86,24.95 12.86,24.86 12.69,24.69 12.55,24.55 9.7,24.55
  Top 0.125: U1.9 23.5,14.29 24.88,15.68 27.55,15.68 29.88,18.01 29.88,20.66 30.15,20.93 30.15,21.76 29.78,22.13 28.32,22.13 27.86,22.59 27.8,22.59 27.71,22.68 27.39,22.68 27.35,22.64 26.75,23.24 26.75,24.33 27.32,24.9 27.32,27.91 26.89,28.34 21.88,28.34 21.3,28.92 20.4,28.92 20,29.32 17.33,29.32 15.64,27.63 13.3,27.63 12.86,27.19 12.86,26.37 12.86,24.95
  Top 0.152: P12.P$1 12.88,26.35 12.86,26.37
  Top 0.254: 12.69,24.69 12.57,24.69 12.4,24.51 10.39,24.51
  Top 0.4: U$27.P$3 10.39,24.51
GPIO12  (via drill 0.35)
  Top 0.1: U1.17 21.11,17.95 | 21.11,17.95 21.11,17.98 21.12,17.99 | 21.11,17.95 20.73,18.33 18.21,18.33 17.73,18.81 17.73,19.11 | v16.74,21.3 16.74,22.44 15.75,23.43 | v18.77,21.13 18.77,20.99 18.17,20.39
  Top 0.125: 17.73,19.11 17.73,19.95 18.17,20.39 | 15.75,23.43 15.29,23.88 14.71,23.88
  Top 0.152: 13.48,24.01 13.47,24 P13.P$1
  Top 0.254: U$27.P$4 13.48,24.01 14.59,24.01 14.71,23.88
  Top 0.4: U$27.P$4 13.36,24.01 P13.P$1
  Bottom 0.1: v18.77,21.13 16.91,21.13 v16.74,21.3
GPIO38-SDA  (via drill 0.35)
  Top 0.152: 15.34,9.55 v15.21,9.42
  Top 0.2: U1.43 16.71,9.87 16.25,9.42 v15.21,9.42 | 15.34,9.55 14.8,9.55 R36.P$2
  Bottom 0.125: 23.18,11.49 19.13,7.44 16.82,7.44 15.21,9.06 v15.21,9.42 | Q5.2 24.36,15.48 23.18,14.3
  Bottom 0.127: 23.18,11.49 23.18,14.3
  Bottom 0.152: v15.21,9.42 15.35,9.27
GPIO38-SDA-  (via drill 0.3, 0.35)
  Top 0.125: 12.43,22.04 12.41,22.04 12.19,22.04 | 12.27,22.12 13.25,22.12 13.2,22.16 13.2,22.25 v13.25,22.3
  Top 0.127: 24.95,30.39 25.4,30.39 26.52,30.39
  Top 0.15: v29.85,14.87 31.85,16.87 31.85,18.21 | 26.52,30.39 29.5,27.41 30.51,27.41
  Top 0.152: v12.48,28.93 14.11,30.56 16.22,30.56 16.74,30.04 19.07,30.04 19.37,30.34 20.39,30.34 20.45,30.39 24.95,30.39 | v31.42,26.14 31.37,26.2 31.37,26.55 30.51,27.41 | P17.P$1 13.46,22.25 13.2,22.25
  Top 0.154: 32.22,25.53 31.53,26.21 31.49,26.21 v31.42,26.14 | 32.35,19.18 J36.2
  Top 0.2: 32.22,25.53 32.22,19.31 32.35,19.18
  Top 0.254: 31.85,18.21 32.35,18.71 32.35,19.18 | 12.27,22.12 12.19,22.04 | 12.41,22.04 12.38,22.01 U$27.P$8
  Top 0.4: 12.33,22.01 12.31,22.01 U$27.P$8
  Bottom 0.125: v13.25,22.3 v13.26,22.31 13.26,22.66 12.28,23.64 12.28,28.73 v12.48,28.93
  Bottom 0.254: R11.P$1 30.96,26.57 31.4,26.13 v31.42,26.14 | Q5.3 27.13,14.92 29.8,14.92 v29.85,14.87
GPIO39-SCL  (via drill 0.35)
  Top 0.1: v29.94,15.73 30.14,15.73 31.39,16.98 31.39,18.7 v31.68,18.99
  Top 0.125: R35.P$1 v15.21,8.33 v15.21,8.32
  Top 0.152: R35.P$1 14.68,8.33 | 15.21,7.56 v15.21,8.32 | U1.44 17.11,9.46
  Top 0.2: 15.21,7.56 17.11,9.46
  Bottom 0.125: 23.52,12.52 23.52,14.01 24.13,14.61 24.91,14.61 25.5,14.61 25.5,14.62 25.53,14.62 25.72,14.81
  Bottom 0.127: 32.79,21.33 32.76,21.36
  Bottom 0.152: 32.76,21.36 32.76,21.64 32.29,22.11 Q6.2 | 23.52,12.52 23.52,11.37 19.27,7.11 16.32,7.11 15.21,8.22 v15.21,8.32
  Bottom 0.2: v31.68,18.99 v31.69,19 31.69,21.5 32.29,22.11
  Bottom 0.254: 25.72,14.81 25.72,15.24 26.22,15.74 v29.93,15.74 v29.94,15.73
GPIO39-SCL-  (via drill 0.3, 0.35)
  Top 0.1: 33.02,25.49 30.81,27.7 29.69,27.7 26.57,30.83 24.96,30.83 | J36.1 32.85,20.45 | 10.36,22.51 12.49,22.51 12.57,22.59 v12.57,22.63
  Top 0.125: 13.66,30.93 12.58,29.84 v12.47,29.84
  Top 0.152: 18.32,30.83 18.32,30.69 18.06,30.43 16.91,30.43 16.41,30.93 13.66,30.93 | P16.P$1 33.03,23.07 32.65,23.07
  Top 0.154: v33.09,25.49 33.02,25.49
  Top 0.2: 24.96,30.83 18.32,30.83 | v33.09,25.49 32.65,25.05 32.65,23.07 32.65,20.65 32.85,20.45
  Top 0.254: v33.09,25.49 33.09,25.52
  Top 0.4: U$27.P$7 10.36,22.51
  Bottom 0.1: Q6.3 33.28,25.3 v33.09,25.49
  Bottom 0.12: 12,29.44 12,23.56 12.57,22.99 v12.57,22.63
  Bottom 0.125: v12.47,29.84 12.39,29.84 12,29.44
  Bottom 0.2: 33.19,24.18 Q6.3 32.91,24.55
  Bottom 0.254: R12.P$1 33.4,24.39 33.19,24.18
GPIO40
  Top 0.125: 16.51,8.28 15.6,7.37 14.97,6.74 PWR.-
  Top 0.152: U1.45 17.51,9.28 16.51,8.28
GPIO41  (via drill 0.35)
  Top 0.152: v17.8,11.34 18.33,10.81 18.33,10.21 U1.47 | P18.P$1 15.12,22.96 15.12,23.32 15.04,23.4 v15,23.4
  Bottom 0.152: v17.8,11.34 17.75,11.39 17.48,11.39 14.6,14.27 14.6,23.39 14.7,23.39 | v15,23.4 14.86,23.54 14.86,23.55
  Bottom 0.254: 14.7,23.39 14.86,23.55 15.04,23.73 15.04,25.01 15.31,25.28 16.46,25.28 16.72,25.28 18.22,23.78 | 20.01,23.78 19.7,23.78 19.7,23.32 K112.P$2 | 19.64,26.37 R21.P$1 19.66,26.11
  Bottom 0.54: R21.P$1 20.01,25.76 20.01,23.78
  Bottom 1: 18.22,23.78 19.7,23.78
GPIO42  (via drill 0.35)
  Top 0.125: v18.64,37.19 18.64,37.4 20,38.76 23.87,38.76 24.67,37.97 v24.67,37.75 | 25.57,41.47 J3.3
  Top 0.152: v18.53,9.17 18.53,9.35 18.71,9.53 U1.48
  Top 0.254: R19.P$1 27.53,39.51
  Top 1: 27.53,39.51 25.57,41.47
  Bottom 0.1: 25.5,41.44 25.52,41.41 | 11.74,29.98 13.2,31.44 13.2,33.96 15.38,36.14 15.38,36.16 | 12.3,22.2 12.44,22.06 12.77,22.06 13.16,21.67 13.16,21.34 13.17,21.33
  Bottom 0.125: 11.74,29.98 11.74,22.72 12.26,22.2 12.3,22.2 | 15.38,36.16 17.65,36.16 18.68,37.19 v18.64,37.19 | v24.67,37.75 25.52,38.61 | 13.47,13.58 13.47,21.04 13.17,21.33 | J3.3 25.5,41.44
  Bottom 0.152: v18.53,9.17 18.03,9.67 17.37,9.67 13.47,13.58
  Bottom 0.54: 25.52,38.61 25.52,41.41
GPIO45  (via drill 0.3)
  Top 0.152: U1.51 19.91,9.49 19.49,9.07 v19.33,9.23 | 20.72,40.43 20.81,40.34 | J3.1 20.59,41.38
  Top 0.254: R20.P$1 26.4,39.13 25.46,40.07 21.08,40.07 | 20.59,40.56 20.72,40.43
  Top 0.524: 20.59,41.38 20.59,40.56
  Top 0.54: 20.81,40.34 21.08,40.07
  Bottom 0.1: 12.98,30.13 13.45,30.6 13.45,33.67 13.48,33.65
  Bottom 0.125: 17.43,10.05 13.78,13.7 13.78,22.5 12.55,23.73 12.55,27.98 12.98,28.4 12.98,30.13 | 20.25,37.84 18.14,35.73 15.56,35.73 13.48,33.65 | 20.25,41.22 J3.1
  Bottom 0.127: v19.33,9.23 18.51,10.05 17.43,10.05
  Bottom 0.54: 20.25,37.84 20.25,41.22
GPIO46_BL  (via drill 0.3)
  Top 0.127: v20.17,11.27 20.17,11.19 | 20.17,11.19 20.15,11.17 | 20.17,11.19 20.31,11.33 U1.52
  Bottom 0.125: R30.P$1 15.02,21.77 14.97,21.77 14.97,14.38 17.52,11.83
  Bottom 0.127: v20.17,11.27 v20.17,11.28 19.62,11.83 17.52,11.83
LCD-3.3  (via drill 0.35)
  Top 0.254: LCD.3 20.24,27.68 20.47,27.91 v20.47,28.14 | v20.47,28.14 20.47,28.06 20.74,27.79 LCD.4 | P2.P$1 20.47,28.21 v20.47,28.14
  Bottom 0.125: v20.47,28.14 20.76,28.14 20.78,28.16
  Bottom 0.254: R14.P$1 26.82,27.37 R29.P$1 R13.P$1 22.37,27.37 21.95,27.79 Q10.3 21.87,28.26 20.67,28.26 20.78,28.16 21.95,26.98 C11.1 | 20.47,28.18 v20.47,28.14
LCD-D/C_IO2  (via drill 0.35)
  Top 0.1: 23.51,13.92 25.03,15.44 27.65,15.44 30.14,17.94 30.14,19.87 30.79,20.51 30.79,23.08 30.74,23.12 | LCD.7 22.26,26.89 22.24,26.87 | v22.1,25.43 22.24,25.57 | v28.04,25.8 28.04,25.73 28.06,25.71 29.46,25.71 30.22,24.95 30.22,23.64 30.74,23.12 | 30.74,23.12 30.36,22.74 P3.P$1
  Top 0.127: U1.8 22.84,13.92 23.51,13.92
  Top 0.25: 22.24,26.87 22.24,25.57
  Top 0.254: LCD.7 22.22,26.93
  Bottom 0.1: v22.1,25.43 22.02,25.51 22.02,25.6 22.89,26.47 24.03,26.47 24.3,26.2 24.3,25.64 24.99,24.95 27.19,24.95 v28.04,25.8
LCD_CLK  (via drill 0.35)
  Top 0.1: 22.77,16.96 23.38,17.57 28.12,17.57 28.83,18.28 28.83,20.31 27.6,21.54 26.67,21.54 24.27,23.94 v24.07,23.94 | 23.15,26.82 23.2,26.87 23.22,27.09 23.24,27.31 LCD.9 | v23.1,25.42 23.22,25.54
  Top 0.125: 22.48,16.96 23.32,16.96 P5.P$1
  Top 0.152: U1.15 22.14,16.96 22.48,16.96 22.77,16.96
  Top 0.2: 23.22,25.54 23.22,27.09
  Top 0.254: P5.P$1 23.24,17.34
  Bottom 0.1: v24.07,23.94 24.17,24.04 23.1,25.11 v23.1,25.42
LCD_CS  (via drill 0.35)
  Top 0.1: v22.61,17.52 22.61,17.81 28.04,17.81 28.6,18.37 28.6,20.22 27.68,21.14 27.5,21.14 | 27.29,20.38 P4.P$1 27.29,20.93 27.5,21.14 | v23.99,23.21 24.16,23.04 24.72,23.04 26.62,21.14 27.5,21.14 | v22.52,24.78 22.61,24.87 22.61,25.74 22.74,25.87
  Top 0.127: v24.49,17.06 24.42,17.06 24.55,16.93 23.91,16.29 U1.14
  Top 0.25: LCD.8 22.74,25.87
  Bottom 0.1: v23.99,23.21 23.99,23.31 v22.52,24.78
  Bottom 0.127: v22.61,17.52 23.07,17.06 v24.49,17.06
LCD_MISO  (via drill 0.35)
  Top 0.1: v24.54,24.7 24.16,24.7 23.51,24.05 23.51,22.94 23.86,22.59 24.56,22.59 | 23.73,25.94 23.71,25.94 v23.75,25.98 | P6.P$1 25.96,20.54 26.28,20.87
  Top 0.11: P6.P$1 25.96,20.81 26.01,20.86
  Top 0.15: 27.98,18.11 28.34,18.47 28.34,19.78
  Top 0.152: U1.16 21.51,18 21.62,18.11 27.98,18.11 | 28.34,19.78 28.05,20.07 27.08,20.07 26.28,20.87 24.56,22.59
  Top 0.25: LCD.10 23.73,25.94
  Bottom 0.1: v24.54,24.7 24.54,24.93 23.89,25.58 23.89,25.68 23.75,25.82 v23.75,25.98
LCD_RST
  Top 0.1: 22.59,24.15 24.12,25.69 24.24,25.8 24.24,25.98
  Top 0.11: U1.19 20.29,17.21 20.29,17.74 20.16,17.87 18.01,17.87 16.85,19.04 16.85,19.24 | 24.24,25.98 LCD.11
  Top 0.125: 22.59,24.15 22.31,24.15 22.3,24.16 21.9,24.16 21.62,23.87 21.62,23.47 21.65,23.44 21.65,22.88 20.7,21.93 17.76,21.93 17.75,21.94 17.23,21.42 17.23,21.1 16.76,20.64 P7.P$1 | 16.98,20.14 16.85,20.01 16.85,19.24
  Top 0.254: 16.98,20.14 P7.P$1
LEDK  (via drill 0.35)
  Top 0.076: P1.P$1 17.93,27.97
  Top 0.1: LCD.2 19.72,26.93 | 18.59,27.95 v18.57,27.97
  Top 0.2: 17.93,27.97 v18.57,27.97
  Top 0.25: 19.72,26.93 19.72,28.04 19.49,28.27 18.91,28.27 18.59,27.95
  Bottom 0.1: v18.57,27.97 17.86,27.26 R2.2
  Bottom 0.254: v18.57,27.97 17.48,26.88 17.48,26.8
MISO
  Top 0.152: U1.34 15.28,14.29 13.86,12.87 5.05,12.87 4.76,13.16 4.76,14.5 5.04,14.77 5.89,14.77 U$17.2
N$1
  Top 0.254: Q7.3 33.24,36.48 33.24,39.48 32.87,39.85 32.53,39.85 | Q4.1 31.25,39.85 32.53,39.85 | R16.P$1 32.5,39.82 32.53,39.85
N$2
  Bottom 0.254: RGB2.1 9.24,36.86 7.24,34.86 7.24,30.4 3.1,26.26 3.1,17.31 3.75,16.66 5.07,16.66 RGB1.3
N$3
  Top 0.2: L3.1 17.15,36.02 17.15,36.22 17.15,36.45
  Top 0.54: U2.3 17.15,37.1 17.15,36.22
N$4  (via drill 0.35)
  Top 0.254: v17.64,38.09 18.71,38.09 19.71,39.09 24.24,39.09 26.1,37.23 27.81,37.23 v28.05,36.99
  Bottom 0.254: RGB2.3 12.29,37.32 13.94,37.32 14.71,38.09 v17.64,38.09 | v28.05,36.99 29.82,38.76 31.51,38.76 RGB3.1
N$5
  Top 0.152: 13.87,5.58 PWR.+
  Top 0.254: R10.P$1 13.87,5.42 13.87,5.58
N$6
  Top 0.254: Q3.1 5.9,27.22 | 5.9,27.22 5.34,27.22 | 5.9,27.22 6.81,27.22 R7.P$1 5.57,27.37 Q1.3
N$7
  Top 0.152: R6.P$1 25.52,8.7 | 26.22,7.8 C2.2
  Top 0.3: C2.2 25.52,8.7 | ANT.P$2 26.22,7.8
  Top 0.5: ANT.P$2 28.13,4.32
N$8
  Bottom 0.254: RGB4.1 43.02,20.73 43.02,25.05 33.12,34.95 33.12,38 RGB3.3
N$9
  Top 0.254: 3.01,28.09 Q1.1 3.35,28.14 3.35,29.48 R1.P$1 3.72,29.35 3,30.07 4.53,33.61 4.53,35.5 8.97,39.94 10.9,39.94 R8.P$2
N$10
  Top 0.1: 15.22,20.43 14.22,21.42 14.2,21.44
  Top 0.11: U1.25 17.91,17.64 15.22,20.34 15.22,20.43 14.54,21.1 14.54,21.15 14.54,21.44
  Top 0.152: U1.25 17.89,17.21
  Top 0.154: 14.6,21.15 14.54,21.15 | 14.54,21.44 14.2,21.44 | 14.22,21.42 R43.2
N$11
  cutout Top: 24.42,0.16 29.99,0.16 33.22,3.39 35.72,3.39 43.98,11.65 43.98,11.86 40.84,15 39.21,15 36.26,12.05 31.96,12.05 30.31,10.4 28.29,10.4 24.46,6.57
N$12
  cutout Bottom: 40.87,14.91 37.3,14.91 32.59,10.2 27.03,6.49 25.14,6.49 25.05,6.4 24.37,6.4 24.37,0.11 32.5,0.11 44.08,11.69 42.52,13.24
N$13
  Bottom 0.1: R2.1 17.68,25.74 17.38,26.04 | 15.34,26.04 Q2.3
  Bottom 0.3: 17.38,26.04 15.34,26.04
N$14
  Top 0.254: R40.P$1 R31.P$2 17.28,39.62 15.17,39.62 U2.5 14.16,40.63 14.16,40.86
N$15
  Bottom 0.254: Q2.1 15.89,24.22 R33.P$2 R30.P$2
N$16
  Top 0.11: 14.99,20.2 17.51,17.68 U1.26
  Top 0.154: 14.99,20.2 R44.2
N$17
  Top 0.254: U7.3 6.5,19.14 | 7.44,19.12 R37.P$2 | U7.3 6.73,19.14 R37.P$2 | R4.P$1 R37.P$2 | 7.44,19.12 R3.P$1 | U7.3 7.42,19.14 7.44,19.12
N$18  (via drill 0.35)
  Top 0.254: R37.P$1 8.36,18.43 8.87,17.92 8.87,16.86 8.21,16.2 v8.02,16.2
  Bottom 0.254: 5.73,15.42 RGB1.1 6.74,15.3 7.64,16.2 v8.02,16.2
N$19
  Top 0.152: U1.35 15.32,13.89 13.69,12.26 U$17.5
N$21
  Top 0.152: U1.33 15.2,14.69 14.03,13.53 U$17.6
N$22
  Bottom 0.254: 37.79,16.88 34.73,13.82 31.88,13.82 25.15,7.09 RGB5.1 | 37.79,16.88 37.77,16.9 | 40.04,17.59 40.31,17.54 40.08,17.54 | 40.08,17.54 RGB4.3 | 37.79,16.88 38.45,17.54 40.08,17.54
N$23
  Top 0.152: 13.15,14.83 U$17.7
  Top 0.254: U1.30 15.04,15.89 13.98,14.83 13.15,14.83
N$26
  Bottom 0.125: 21.04,30.28 21.04,30.65 Q10.1
  Bottom 0.254: R15.P$1 27.61,29.35 24.43,29.35 Q11.3 21.96,29.36 21.04,30.28
N$29
  Bottom 0.1: Q11.1 26.64,30.13 28.24,30.13 28.43,29.94 28.43,28.88 28.11,28.56 R22.P$1
N$30
  Top 0.254: R23.P$1 32.01,32.58 Q7.1
N$198
  Top 0.152: 24.5,10.27 C4.2 arc90 23.68,11.09 U1.1
  Top 0.3: R6.P$2 24.5,10.27
N$201
  Top 0.152: U1.53 20.71,9.03 19.47,7.79 19.47,6.49 18.27,5.3 Y1.3 18.33,5.3 18.45,5.3 18.45,4.05 C13.1
N$202
  Top 0.127: U1.54 21.11,7.49 20.76,7.15 Y1.1
  Top 0.152: Y1.1 20.61,7.07 19.44,5.9 19.44,4.47 C9.1
OUT_5V  (via drill 0.35)
  Top 0.1: v36.09,29.56 36.11,29.54 | 36.11,28.88 35.9,28.67 | v35.27,18.43 35.27,18.55 | Q4.3 30.49,36.85
  Top 0.254: v35.27,18.43 35.27,18.41 | 33.49,17.74 J36.3 | v30.05,36.59 30.07,36.57 | 30.07,36.57 30.07,36.26 C10.2 | 30.07,36.57 Q4.3 | J34.3 34.05,28.64 34.08,28.67
  Top 0.5: 36.11,29.54 36.11,28.88 | 35.27,18.55 v35.63,18.91
  Top 0.54: v36.6,29.09 36.18,28.67 35.9,28.67 34.08,28.67 | 35.27,18.41 34.6,17.74 33.49,17.74
  Top 0.8: 30.49,36.85 v30.93,36.85
  Bottom 0.1: 36.21,29.89 36.21,29.68 v36.09,29.56 | 35.27,18.55 v35.27,18.43 | 30.93,35.83 30.6,35.5
  Bottom 0.254: 35.11,18.59 v35.27,18.43 | 36.81,29.01 36.89,28.92 | 30.14,36.5 v30.05,36.59
  Bottom 0.5: 36.6,29.5 36.81,29.3 36.81,29.01 | v35.63,18.91 35.27,18.55
  Bottom 0.54: 36.89,28.92 36.89,22.37 35.11,20.59 35.11,18.59 | 30.14,35.96 30.6,35.5 36.21,29.89 36.6,29.5
  Bottom 0.8: 30.14,36.5 30.14,35.96 | v30.93,36.85 30.93,35.83
RESET  (via drill 0.35)
  Top 0.1: 24.16,12.62 24.16,13.27 25.4,14.5 28.03,14.5 31.15,17.62 31.15,19.43 31.7,19.98 31.7,24.88 30.97,25.61 30.94,25.61 v30.9,25.64
  Top 0.127: RESET.P$4 26.87,29.61 30.68,25.8 30.75,25.8 v30.9,25.64 | U1.4 23.83,12.29 24.16,12.62
  Top 0.152: v30.33,28.75 30.33,29.35 30.22,29.46
  Top 0.254: R50.P$2 28.62,31.73 30.17,30.18 RESET.P$1 30.22,29.46
  Bottom 0.15: 30.26,26.04 30.67,25.64 v30.9,25.64
  Bottom 0.152: v30.33,28.75 30.33,28.47 30.26,28.4 30.26,26.04
  Bottom 0.254: C5.2 30.47,28.89 v30.33,28.75
RGB_DI  (via drill 0.35)
  Top 0.125: v8.24,20.04 8.24,19.52 R3.P$2
  Top 0.127: U1.36 15.84,13.46
  Top 0.154: U1.36 15.79,13.51 15.35,13.51 14.53,12.69 14.53,11.76 14.23,11.46 13.66,11.46 12,11.46 11.17,12.29 11.17,12.31 11.08,12.4 9.85,12.4
  Top 0.254: R28.P$1 13.64,11.44 13.66,11.46 | 9.85,12.4 9.65,12.2 9.08,12.2 | 9.08,12.2 v8.65,12.2 | 9.08,12.2 8.1,11.22 v6.8,11.22 | v3.76,19.72 3.76,19.26 U7.4
  Bottom 0.254: v3.76,19.72 3.82,19.72 4.39,19.15 4.97,18.72 | 4.97,18.72 6.68,18.72 7.04,19.08 8.54,19.08 | 4.97,18.72 4.89,18.72 | 8.54,19.08 8.65,18.97 v8.65,12.2 | 8.54,19.08 8.2,19.41 8.24,19.45 v8.24,20.04
SPICS0  (via drill 0.35)
  Top 0.12: 15.22,15.08 14.16,14.02 9.78,14.02 v9.7,14.1
  Top 0.152: U1.32 15.8,15.08 15.22,15.08
  Top 0.154: 9.62,16.07 v9.7,16.14
  Top 0.254: U$17.1 7.25,16.07 7.71,15.61 8.86,15.61 9.32,16.07 9.62,16.07
  Bottom 0.12: v9.7,16.14 v9.7,14.1
SPIWP
  Top 0.125: U1.31 15.4,15.49 | 11.22,14.35 11.01,14.55 11.01,14.57
  Top 0.152: 15.4,15.49 15.22,15.49 14.01,14.28 11.28,14.28 | U$17.3 8,13.53 9.1,14.62 10.94,14.62
  Top 0.154: 11.28,14.28 11.22,14.35 10.94,14.62
  Top 0.254: R27.P$2 13.14,17.51 12.77,17.51 11.01,15.76 11.01,14.57
TP_INT
  Top 0.1: 26.4,24.46 26.4,23.15 27.19,22.36 27.76,22.36 29.52,20.6 29.52,17.99 27.45,15.91 24.73,15.91 23.51,14.69 | 27.07,25.55 27.07,25.87 26.96,25.97 26.96,26.22 26.74,26.45 26.74,26.55
  Top 0.125: 26.4,24.46 27.07,25.12 27.07,25.55
  Top 0.127: 23.51,14.69 23.4,14.69
  Top 0.15: U1.10 23.4,14.69 | P11.P$1 29.08,21.05 29.08,21.04 | P11.P$1 29.12,21.09 29.12,21 29.42,20.71 | LCD.16 26.74,26.55 | P11.P$1 29.41,21.32 | 29.41,21.32 29.41,20.71 29.53,20.6 | 29.52,20.6 29.52,21.21 29.41,21.32
TP_RST  (via drill 0.35)
  Top 0.1: 17.48,21.25 17.48,20.02 | P8.P$1 20.34,21.51 20.52,21.69
  Top 0.11: U1.18 20.7,17.69 20.29,18.1 18.12,18.1 17.34,18.88 17.34,19.88 17.48,20.02 | 24.72,25.36 24.48,25.36 20.81,21.69 20.52,21.69 17.92,21.69 17.48,21.25 | 24.7,25.34 24.72,25.36 | 24.72,25.36 25.24,25.88
  Top 0.125: 24.7,25.34 24.95,25.59 v25.02,25.59
  Top 0.25: 25.24,25.88 LCD.13
  Bottom 0.1: R13.P$2 24.89,26.4 24.96,26.37 25.02,26.3 v25.02,25.59
TP_SCL  (via drill 0.35)
  Top 0.076: 25.39,16.85 25.16,16.85
  Top 0.1: 23.72,15.59 25,16.87 25.02,16.87 | 25.84,17.34 25.53,17.34 25.07,16.87 25.18,16.87 | 25.84,17.34 28.2,17.34 29.06,18.2 29.06,20.41 27.62,21.85 26.87,21.85 25.77,22.95 v25.77,25.43 25.77,25.87 25.75,25.89 | 25.16,16.85 25.18,16.87 | 25.18,16.87 25.27,16.96 | P9.P$1 25.84,17.14 25.84,17.34 | U1.12 23.48,15.49 | 24.86,16.71 25,16.85 25.52,16.85
  Top 0.125: 23.72,15.59 23.62,15.49 | 23.48,15.49 23.62,15.49 | 23.62,15.49 23.64,15.49 24.86,16.71 25.02,16.87 | P9.P$1 25.52,16.85 25.39,16.85
  Top 0.254: LCD.14 25.75,26.9 25.75,25.89
  Bottom 0.254: 25.95,26.47 R29.P$2 25.64,26.24 25.64,25.43 v25.77,25.43
TP_SDA  (via drill 0.35)
  Top 0.076: P10.P$1 27.19,16.66 27.48,16.37 27.53,16.32
  Top 0.1: 27.53,16.32 29.29,18.08 29.29,20.48 27.66,22.12 27.01,22.12 26.48,22.65 | 26.26,25.05 26.26,25.72 | 27.48,16.37 27.28,16.17 27.28,16.13 | 27.28,16.13 27.29,16.13 27.29,16.45 P10.P$1 | 27.28,16.13 24.61,16.13 23.57,15.09
  Top 0.125: v26.55,25.43 26.26,25.72 26.24,25.72 | 26.48,22.65 26.02,23.1 26.02,24.81 26.26,25.05
  Top 0.127: 23.57,15.09 U1.11
  Top 0.25: 26.24,25.72 LCD.15
  Bottom 0.125: R14.P$2 26.84,26.08 26.55,25.79 v26.55,25.43
  Bottom 0.254: R14.P$2 26.84,26.33
UART0_RXD0-  (via drill 0.3, 0.35)
  Top 0.1: 26.51,31.53 26.62,31.53 29.89,28.25 30.86,28.25 31.63,29.02 | U$27.P$5 9.7,23.55 | v12.19,32.03 13.63,32.03 14.07,31.59 16.51,31.59 v16.74,31.82
  Top 0.125: v16.74,31.82 17.11,31.82 | 26.51,31.53 17.54,31.53 17.25,31.82 | 31.63,29.02 31.63,30.8
  Top 0.127: 17.11,31.82 17.25,31.82 | 16.65,31.73 v16.74,31.82
  Top 0.152: P14.P$1 39.02,32.98 39.04,33
  Top 0.154: J34.1 32.01,31.18 31.63,30.8
  Top 0.254: J34.1 33.41,31.29 38.73,31.29 39.04,31.6 39.04,33 R9.P$1
  Top 0.4: U$27.P$5 9.52,23.53 v10.48,23.53
  Bottom 0.1: v10.48,23.53 v10.49,23.54 10.49,28.23 10.92,28.66 10.92,30.44 11.54,31.06 11.71,31.06 12.24,31.59 12.24,32.03 v12.19,32.03
  Bottom 0.125: Q9.3 14.48,31.18
  Bottom 0.127: v16.74,31.82 16.75,31.83 16.77,31.83 16.4,31.46 15.44,31.46
  Bottom 0.152: 15.44,31.46 14.76,31.46 Q9.3
UART0_TXD0-  (via drill 0.35)
  Top 0.1: 29.71,28.02 26.44,31.28 21.87,31.28 21.83,31.24 | 8.46,23.67 8.46,23.27 8.73,23 10.79,23
  Top 0.125: 8.46,23.61 8.46,23.67 8.46,24.97 8.49,25 7.62,25.87 v7.62,26.58 | v11.52,31.61 11.59,31.54 12.96,31.54 13.24,31.26 | 29.71,28.02 31.06,28.02 31.93,28.89 31.93,29.43 32.31,29.81 32.31,29.87 32.35,29.91 J34.2
  Top 0.127: 21.9,31.24 21.83,31.24 21.46,31.24 | 18.78,31.24 17.28,31.24 v17.15,31.11 17.15,31.26 | 16.72,31.26 13.24,31.26 | 17.21,31.23 17.24,31.26
  Top 0.152: 16.72,31.26 17.15,31.26 17.24,31.26 18.47,31.26 18.45,31.24 18.78,31.24 21.46,31.24 | P15.P$1 40.6,32.24 40.05,32.24
  Top 0.2: 10.79,23 U$27.P$6
  Top 0.25: J34.2 34.72,29.91 35.48,30.67 39.37,30.67 40.05,31.35 40.05,32.24 R5.P$1
  Top 0.254: J34.2 33.58,30.19
  Top 0.4: U$27.P$6 10.83,23 10.81,22.98
  Bottom 0.125: v7.62,26.58 7.62,33.33 8.37,34.08 10.77,34.08 11.52,33.33 v11.52,31.61
  Bottom 0.127: 17.67,31.11 17.29,31.11
  Bottom 0.152: 17.29,31.11 v17.15,31.11
  Bottom 0.254: Q8.3 17.67,31.11
USB-D+  (via drill 0.35)
  Top 0.1: J37.3 8.36,33.11 9.74,34.49 v9.74,34.95 | 13.06,20.26 13.34,20.26 R44.1 | 12.32,21.01 12.82,20.51
  Top 0.154: 13.13,20.2 R44.1 | 13.01,20.32 12.82,20.51 12.63,20.7
  Top 0.254: U$27.P$10 12.32,21.01 13.01,20.32 13.13,20.2 | v12.84,19.62 12.84,20.04 13.06,20.26
  Bottom 0.1: v12.84,19.62 12.84,20.37 11.25,21.96 | 11.23,21.98 11.25,21.96 | 11.31,30.26 11.83,30.79 | 11.83,30.79 12.66,31.61 12.66,33.54 11.25,34.95 v9.74,34.95 | 11.83,30.79 11.83,30.75 11.26,30.17 11.26,21.98 11.25,21.96
USB-D-  (via drill 0.35)
  Top 0.1: v9.03,34.73 9.03,34.9
  Top 0.154: 12.77,21.48 12.78,21.47 13.39,21.47 R43.1
  Top 0.254: 12.77,21.48 v12.68,21.48 12.65,21.51 U$27.P$9 | 9.03,34.9 8.3,34.9 J37.2
  Bottom 0.1: v12.68,21.48 12.59,21.39 11.48,22.5 11.48,30.08 12.95,31.55 12.95,33.61 11.02,35.54 9.41,35.54 9.03,35.16 v9.03,34.73
VCC_5V  (via drill 0.35)
  Top 0.254: U2.1 13.88,37.77 | 13.88,36.63 C18.2 | 13.48,34.31 C17.2 13.24,34.07 12.6,34.07 | 8.53,30.05 8.68,30.2 8.71,30.23 | 8.53,30.05 8.45,29.97 8.45,30.5 | 8.29,30.65 Q3.2 | 8.53,30.05 8.53,30.86 8.33,30.65 | R7.P$2 8.2,27.37 8.52,27.05 8.68,26.89 | 16.22,40.65 U2.4 | 16.22,41.39 16.22,41.89 C16.1 | U7.1 6.51,17.24 v6.96,16.79 6.96,16.82 7.92,16.82 8.34,17.24 R4.P$2 | 12.49,34.31 12.49,34.07 | 9.6,25.53 9.55,25.58 | 9.55,25.58 8.67,26.46 v8.67,26.09 8.92,26.09 U$27.P$1 | 9.55,25.58 9.55,25.53 9.56,25.53 | 9.13,25.53 9.18,25.53 | Q4.2 29.4,39.67 31.49,37.58 32.35,37.58 | 32.35,37.58 v32.39,37.54 | R5.P$2 40.05,33.8 | C20.2 28.48,41.55 28.48,41.57 | R16.P$2 32.5,37.73 32.35,37.58 | v34.59,27.7 37.41,27.7 37.68,27.97 v37.71,27.97 39.67,27.97 41.52,29.82 41.52,32.75 40.27,34 R5.P$2 | 12.49,34.82 12.56,34.89 13.48,34.89 12.73,34.14 P20.P$1 | v11.12,5.86 v11.13,5.85 11.51,5.85 11.1,6.26 C19.1 | R9.P$2 40.03,34.02 R5.P$2 | U$27.P$2 11.66,25.18 11.33,25.51
  Top 0.5: U$27.P$1 11.33,25.51
  Top 0.54: 13.88,37.77 13.88,36.63 | 12.9,38.36 12.9,38.89 | 15.68,41.93 16.22,41.39 16.22,40.65 | C16.1 16.25,42.48 16.76,42.99 27.06,42.99 28.48,41.57 29.07,40.98 Q4.2
  Top 0.7: C18.2 12.8,36.23 v12.57,36.46 12.61,36.5 12.61,38.07 12.9,38.36 12.9,41.38 13.45,41.93 15.68,41.93
  Top 0.8: 9.18,25.53 9.56,25.53 | 8.52,27.05 8.52,26.14 9.13,25.53 | 8.68,30.2 8.68,26.89 | 8.33,30.65 Q3.2 | 12.49,34.31 12.26,34.31 8.45,30.5 | 12.49,34.07 12.6,34.07
  Top 1: C18.2 13.48,34.89 13.48,34.31 13.48,34.07 | 8.71,30.23 8.29,30.65 | 12.49,34.82 12.49,34.31
  Bottom 0.254: 31.73,29.05 C15.1 31.78,29.05 31.78,27.47 | 33.34,27.49 R12.P$2 33.34,27.49 32.77,27.49 | 32.77,27.49 32.59,27.49 | 24.35,4.54 RGB5.2 24.3,3.09 23.75,2.54 17.1,2.54 15.64,4 13.51,4 11.57,5.84 11.14,5.84 v11.12,5.86 11.12,6.26 | v12.57,36.46 12.44,36.59 11.64,36.59 11.08,37.16 RGB2.2 | v6.96,16.79 6.82,16.79 6.14,16.11 RGB1.2 5.33,15.85 4.87,15.85 4.57,15.55 4.57,14.7 5.77,13.5 5.99,10.82 7.28,8.47 8.87,6.93 10.41,6.93 10.68,6.67 10.71,6.67 11.12,6.26 | 40.87,18.37 RGB4.2 40.28,18.33 39.32,18.61 37.55,20.3 37.55,27.81 v37.71,27.97 37.71,29.44 32.43,34.72 32.43,37.5 | 9.41,12.83 9.07,13.17 9.07,25.69 v8.67,26.09 | 9.41,12.83 9.5,12.74 | 9.41,12.83 12.24,10.46 12.3,7.61 11.86,7.11 11.86,7 11.12,6.26 | RGB3.2 32.43,38.49 32.43,37.5 | v32.39,37.54 32.43,37.5 | 31.78,27.47 32.75,27.47 | 32.75,27.47 32.77,27.49 | 32.75,27.47 34.37,27.47 v34.59,27.69 v34.59,27.7 | R11.P$2 31.78,27.47 | 11.12,6.26
VDD_3.3V  (via drill 0.3, 0.35)
  Top 0.1: 28.15,35.66 28.69,35.12
  Top 0.15: 16.95,6.42 16.95,5.8
  Top 0.152: 27.91,35.01 28.57,35.01 | 29.28,35.01 29.3,35.03 v29.22,35.03
  Top 0.2: R35.P$2 13.72,9.33 R36.P$1 | U1.46 17.91,9.06 16.95,8.1 | U1.55 21.51,7.92 21.69,7.74 21.69,6.8 21.85,6.64 | U1.56 21.91,8.81 21.85,8.75 21.85,6.64 | 21.85,6.64 22.2,6.29 | C3.2 22.29,6.57 | 22.55,6.83 v22.64,6.83
  Top 0.254: L3.2 21.7,35.95 | 22.81,35.84 C12.2 | 22.94,35.97 22.81,35.84 | 22.81,35.84 22.69,35.72 | 26.51,35.97 26.95,35.97 C14.1 27.43,35.9 | R50.P$1 28.57,35.01 | 28.57,35.01 28.32,35.01 | 22.2,6.29 C3.2 | 16.95,8.1 16.95,6.42 16.95,6.14 | v16.42,6.08 16.51,5.99 16.95,6 16.95,5.8 16.95,5.65 C7.1 R10.P$2 | R35.P$2 13.63,7.95 v13.31,7.63 | 28.88,35.31 28.69,35.12 28.57,35.01 | R19.P$2 R20.P$2 27.93,37.97 | 28.71,35.98 v28.88,35.98 v28.86,35.99 28.86,37.13 28.87,37.13 28.04,37.96 R19.P$2 | R40.P$2 18.87,39.01 19.4,39.54 24.75,39.54 26.33,37.96 R19.P$2 | R28.P$2 13.7,10.24 R36.P$1 | U7.6 3.92,16.96 3.92,16.05 4.55,15.42 7.18,15.42 7.54,15.06 10.06,15.06 v10.4,15.4 | 33.33,15.34 33.43,15.44 v33.43,15.51 | 27.93,13.47 27.92,13.48 | 27.91,31.35 v27.82,31.26 | v27.18,31.62 27.52,31.62 27.91,32.02
  Top 0.3: L2.1 27.92,13.48 28.37,13.48 v28.41,13.52 | 29.22,13.48 C8.1
  Top 0.4: 22.29,6.57 22.55,6.83
  Top 0.5: 27.91,31.35 27.91,31.52 | 27.91,35.01 27.91,32.69 | C8.1 29.54,13.47 31.41,15.34 33.33,15.34 v34.12,15.34
  Top 0.524: R50.P$1 29.28,35.01
  Top 0.54: v28.88,35.98 28.88,35.31 | C8.1 27.93,13.47 | 27.91,32.69 27.91,32.02 27.91,31.35
  Top 0.8: 21.7,35.95 22.69,35.72 | 22.94,35.97 C36.2 26.51,35.97 | 28.32,35.01 27.43,35.9
  Bottom 0.076: 15.87,29.27 15.6,29.27
  Bottom 0.1: Q9.1 15.6,29.07 | Q9.1 15.6,28.85 | Q9.1 16.08,28.83 16.08,28.54 16.16,28.46 18.17,28.46 18.94,29.23 Q8.1
  Bottom 0.125: Q5.1 24.77,13.65 | 15.71,6.46 15.82,6.46 15.93,6.35 | v10.4,15.4 10.42,15.38 10.42,15.37
  Bottom 0.127: R38.P$2 19.87,33.49 R39.P$1
  Bottom 0.2: 22.78,7 22.64,6.86 v22.64,6.83 | v13.31,7.63 13.31,10.4 10.46,13.25 10.46,15.33
  Bottom 0.254: 15.6,28.85 15.6,29.07 15.6,29.27 Q9.1 | v16.42,6.08 15.99,6.29 | v13.31,7.63 15.71,6.46 15.93,6.35 | R39.P$1 20.14,33.47 20.68,32.93 20.68,32.43 | 19.35,27.22 R21.P$2 19.36,27.31 19.36,28.98 Q8.1 20.04,30.5 20.04,31.29 20.68,31.93 20.68,32.43 | Q6.1 34.37,22.28 | 29.22,36.04 29.08,36.18 v28.88,35.98 | 19.13,6.48 19.14,6.49 | 34.23,15.45 v34.12,15.34 | 10.42,15.37 10.46,15.33 | Q5.1 24.65,13.53 24.65,13.1 24.12,12.57 24.12,11.34 21.61,8.83 21.61,7.63 22.41,6.83 v22.64,6.83 | 26.73,13.14 26.73,13.1 | 34.23,15.93 33.81,15.51 v33.43,15.51 | 27.13,13.14 27.09,13.1 25.61,13.1 | 20.68,32.43 21.09,32.43 C6.1 Q10.2 23.55,31.34 27.17,31.34 | 27.81,31.01 28.04,31.24 27.68,31.24 | 27.68,31.24 27.7,31.26 v27.82,31.26 28,31.08 28,30.63 27.93,30.63 R15.P$2 | 27.68,31.24 27.15,31.24 27.17,31.26 27.17,31.34 | 27.17,31.34 v27.17,31.61 v27.18,31.62
  Bottom 0.3: Q5.1 24.42,13.58 | 24.65,13.1 25.61,13.1 25.88,13.1 | 26.73,13.14 27.13,13.14 28.03,13.14 v28.41,13.52
  Bottom 0.4: 15.93,6.35 15.99,6.29 | 19.35,6.48 19.13,6.48 16.82,6.48 v16.42,6.08 | v22.64,6.83 22.3,6.49 19.14,6.49
  Bottom 0.54: v29.22,35.03 29.51,35.03 36.18,28.37 36.18,23.23 35.09,22.14 Q6.1 34.23,15.93 34.23,15.45
  Bottom 0.554: v29.22,35.03 29.22,36.04
VDD_SPI
  Top 0.125: U$17.8 13.35,16.29 14.24,16.29
  Top 0.152: U1.29 14.5,16.29 | 13.16,16.07 U$17.8
  Top 0.2: U1.29 15.37,16.28
  Top 0.254: 13.16,16.07 13.58,16.48 13.77,16.29 | U1.29 14.24,16.29 13.97,16.29 14.13,16.46 R27.P$1 C1.1
VUSB_IN
  Top 0.152: 6.87,35.69 6.83,35.65
  Top 0.254: 5.32,30.15 5.27,30.1 5.1,30.25 R1.P$2 4.89,30.25 4.93,30.19 Q3.3
  Top 0.524: P19.P$1 6.87,35.69
  Top 1: 5.32,30.15 5.32,35.09 5.88,35.65 6.83,35.65 J37.1

## Text on the board
tPlace: USB | 5V | D- | D+ | GND | RX | TX | 5V | 5V | 5V | GND | UART | IO12 | IO4 | RX | TX | SCL | SDA | D- | SCL | D+ | SDA | GND | GND | 5V | I2C | GND | V1.0 | ESP32 Display 1.28